# Altium schematic sheet sheet2.SchDoc
size 420 x 297 mm; DocumentNumber: МИЭТ.000000.001; SheetNumber: 2
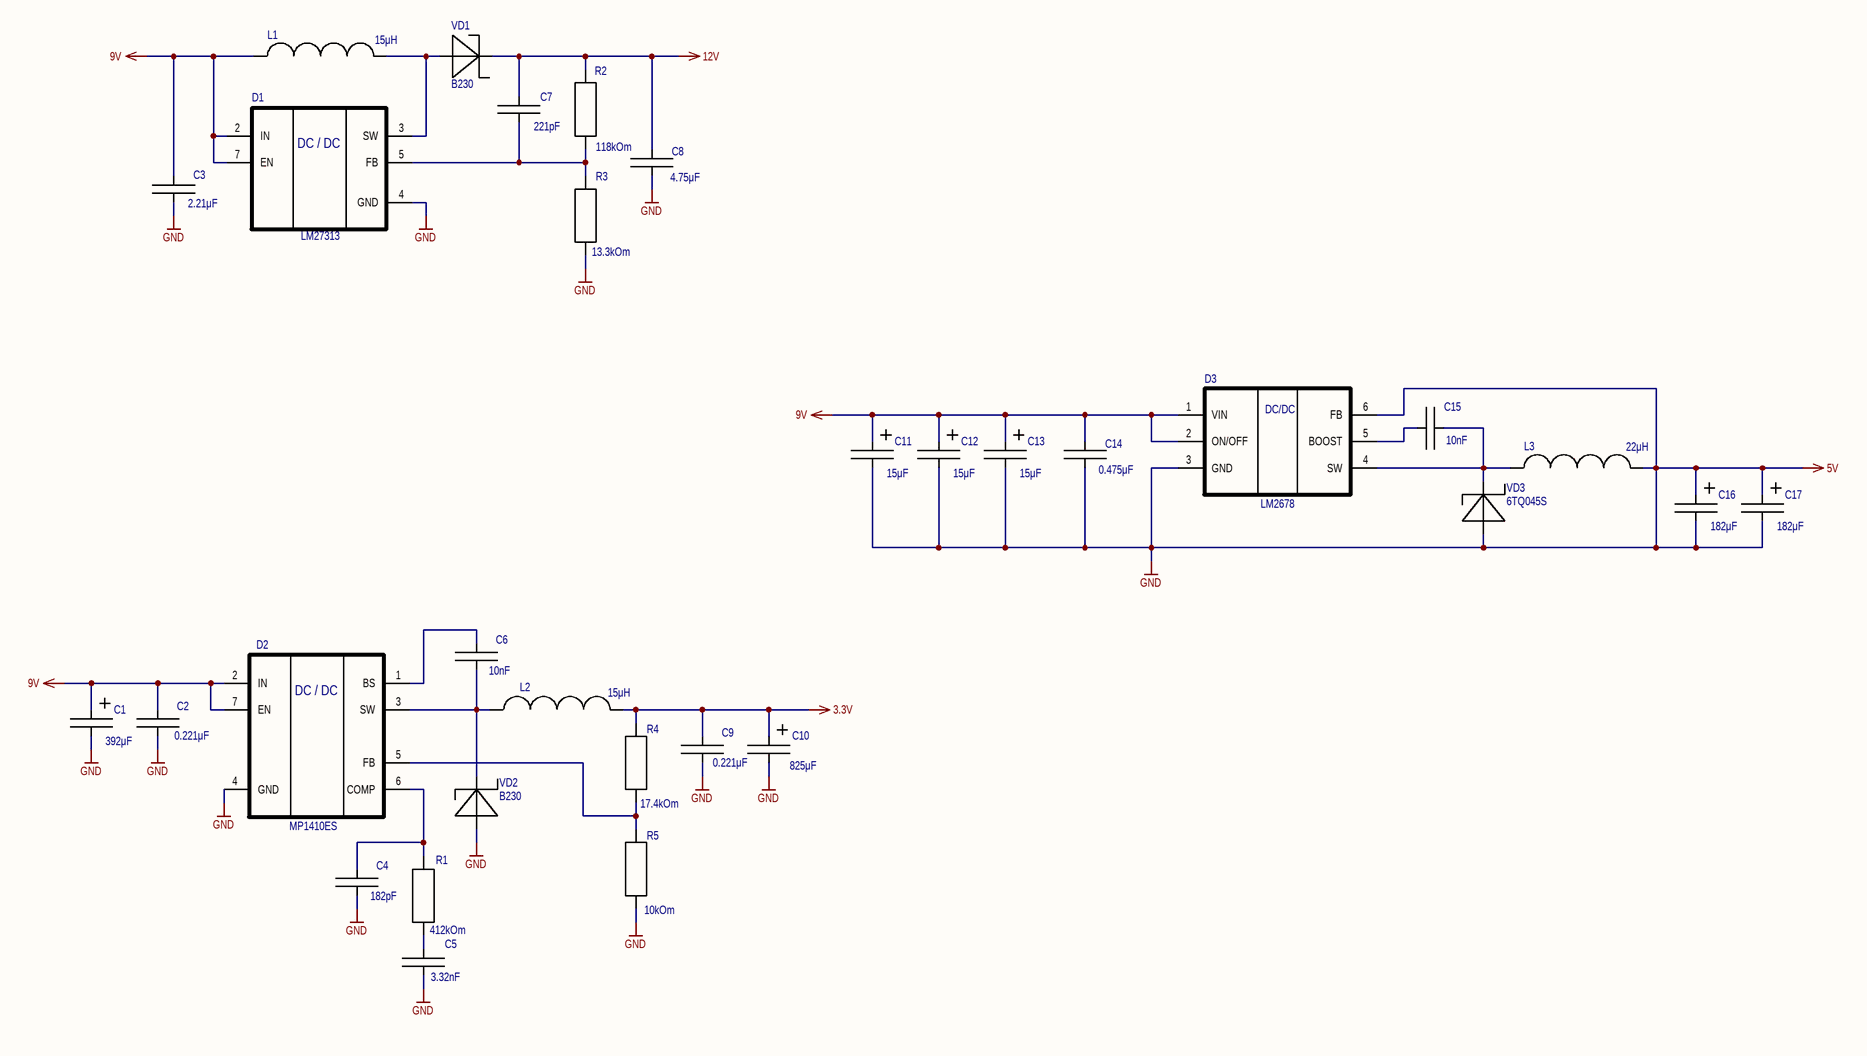
[diagram p0: sheet2.SchDoc]

## Parts
C1  value 392μF  (hidden comment: 392μFФ ±* * * *, *)
C2  value 0.221μF  (hidden comment: 0.221μFФ ±* * * *, *)
C3  value 2.21μF  (hidden comment: 2.21μFФ ±* * * *, *)
C4  value 182pF  (hidden comment: 182pFФ ±* * * *, *)
C5  value 3.32nF  (hidden comment: 3.32nFФ ±* * * *, *)
C6  value 10nF  (hidden comment: 10nFФ ±* * * *, *)
C7  value 221pF  (hidden comment: 221pFФ ±* * * *, *)
C8  value 4.75μF  (hidden comment: 4.75μFФ ±* * * *, *)
C9  value 0.221μF  (hidden comment: 0.221μFФ ±* * * *, *)
C10  value 825μF  (hidden comment: 825μFФ ±* 6.3V * *, *)
C11  value 15μF  (hidden comment: 15μFФ ±* * * *, *)
C12  value 15μF  (hidden comment: 15μFФ ±* * * *, *)
C13  value 15μF  (hidden comment: 15μFФ ±* * * *, *)
C14  value 0.475μF  (hidden comment: 0.475μFФ ±* * * *, *)
C15  value 10nF  (hidden comment: 10nFФ ±* * * *, *)
C16  value 182μF  (hidden comment: 182μFФ ±* * * *, *)
C17  value 182μF  (hidden comment: 182μFФ ±* * * *, *)
D1  LM27313
D2  MP1410ES
D3  LM2678
L1  15μH
L2  15μH
L3  22μH
R1  value 412kOm
R2  value 118kOm
R3  value 13.3kOm
R4  value 17.4kOm
R5  value 10kOm
VD1  B230
VD2  B230
VD3  6TQ045S

## Nets
3.3V: C9.2 C10.1 L2.9 R4.2
5V: C1.2 C2.1 C3.1 C4.1 C5.1 C8.1 C9.1 C10.2 C11.2 C12.2 C13.2 C14.1 C16.1 C16.2 C17.1 C17.2 D1.4(GND) D2.4(GND) D3.3(GND) D3.6(FB) L3.9 R3.2 R5.1 VD2.10 VD3.10  [also labelled GND]
9V: C1.1 C2.2 C3.2 C11.1 C12.1 C13.1 C14.2 D1.2(IN) D1.7(EN) D2.2(IN) D2.7(EN) D3.1(VIN) D3.2(ON/OFF) L1.8
12V: C7.2 C8.2 R2.1 VD1.11
NetC4_2: C4.2 D2.6(COMP) R1.2
NetC5_2: C5.2 R1.1
NetC6_1: C6.1 D2.3(SW) L2.8 VD2.11
NetC6_2: C6.2 D2.1(BS)
NetC7_1: C7.1 D1.5(FB) R2.2 R3.1
NetC15_1: C15.1 D3.4(SW) L3.8 VD3.11
NetC15_2: C15.2 D3.5(BOOST)
NetD1_3: D1.3(SW) L1.9 VD1.10
NetD2_5: D2.5(FB) R4.1 R5.2

## Notes on the sheet
- Подп. и дата
- Инв.№ дубл.
- Взам. инв. №
- Инв № подл.
- Изм.
- Лист
- № докум.
- Подп.
- Дата
- Копировал
- Формат А3
- (in symbol LM2678) DC/DC
- (in symbol LM27313) DC / DC
- (in symbol MP1410ES) DC / DC

## Library data of the parts
C1 C10-C13 C16 C17 = C+: Company: *; Tolerance: *; Type: *; PartNumber: *; Package: *
  C1 C11-C13 C16 C17: Voltage: *
  C10: Voltage: 6.3V
C2-C9 C14 C15 = C: Company: *; PartNumber: *; Tolerance: *; Voltage: *; Type: *; Package: *
L1-L3 = L
  L1 L2: Value: 15μH
  L3: Value: 22μH
R1-R5 = R: Company: *; PartNumber: *; Package: *; Tolerance: *
VD1-VD3 = diode_shottki